# Altium schematic sheet DRV2700.SchDoc
size A4
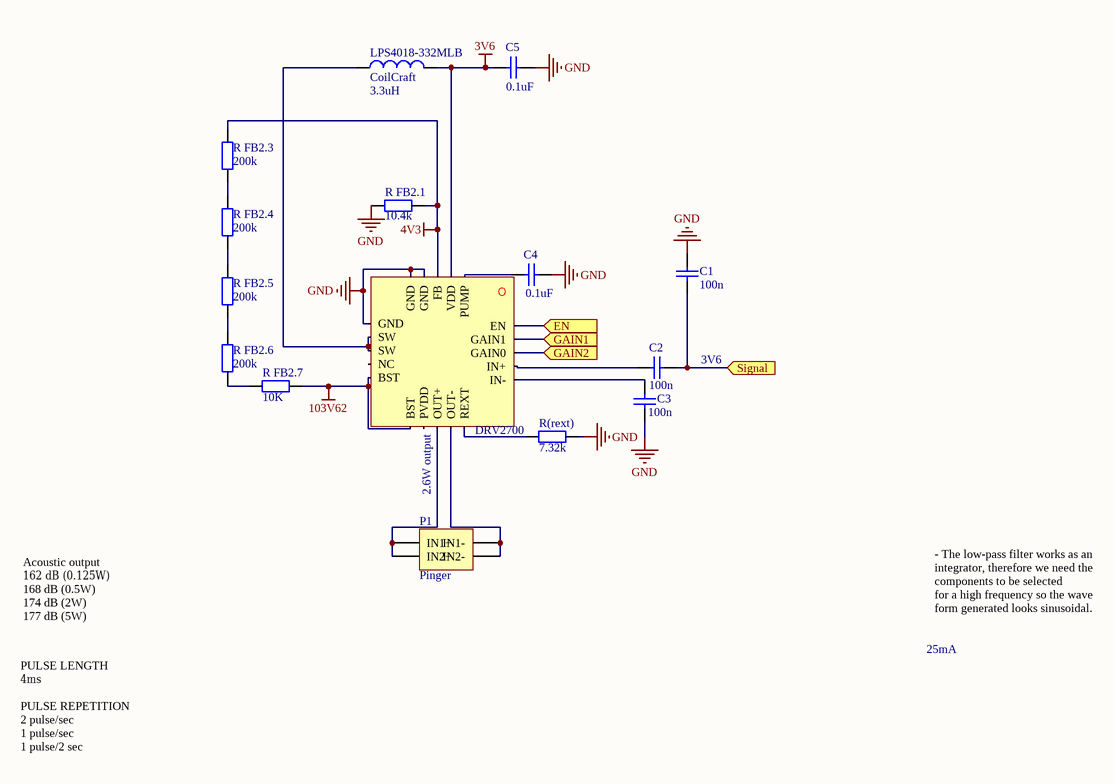
[diagram p0: DRV2700.SchDoc]

## Parts
C1  value 100n  [RAD-0.3]  (hidden comment: Cap)
C2  value 100n  [RAD-0.3]  (hidden comment: Cap)
C3  value 100n  [RAD-0.3]  (hidden comment: Cap)
C4  value 0.1uF  [RAD-0.3]  (hidden comment: +10V rating and X5R or X7R)
C5  value 0.1uF  [RAD-0.3]  (hidden comment: +10V rating and X5R or X7R)
DRV  DRV2700  [QFN50P400X400X100_HS-21N]
LPS4018-332MLB  CoilCraft  value 3.3uH  [0402-A]
P1  Pinger  [HDR2X2]
R(rext)  value 7.32k  [AXIAL-0.4]  (hidden comment: Res2)
R_FB2.1  value 10.4k  [AXIAL-0.4]  (hidden comment: Res2)
R_FB2.3  value 200k  [AXIAL-0.4]  (hidden comment: Res2)
R_FB2.4  value 200k  [AXIAL-0.4]  (hidden comment: Res2)
R_FB2.5  value 200k  [AXIAL-0.4]  (hidden comment: Res2)
R_FB2.6  value 200k  [AXIAL-0.4]  (hidden comment: Res2)
R_FB2.7  value 10K  [AXIAL-0.4]  (hidden comment: Res2)

## Ports
EN (in), GAIN1 (in), GAIN2 (in), Signal (in)

## Nets
3V6: C5.2 DRV.2(VDD) LPS4018-332MLB.2
4V3: DRV.3(FB) R_FB2.1.2 R_FB2.3.1
103V62: DRV.10(BST) DRV.11(BST) R_FB2.7.2
GND: C1.1 C3.1 C4.1 C5.1 DRV.4(GND) DRV.5(GND) DRV.6(GND) R(rext).1 R_FB2.1.1
EN: DRV.20(EN) ; port EN
GAIN1: DRV.19(GAIN1) ; port GAIN1
GAIN2: DRV.18(GAIN0) ; port GAIN2
Signal: C1.2 C2.1 ; port Signal
NetC2_2: C2.2 DRV.17(IN+)
NetC3_2: C3.2 DRV.16(IN-)
NetC4_2: C4.2 DRV.1(PUMP)
NetDRV_7: DRV.7(SW) DRV.8(SW) LPS4018-332MLB.1
NetDRV_13: DRV.13(OUT+) P1.1(IN1+) P1.3(IN2+)
NetDRV_14: DRV.14(OUT-) P1.2(IN1-) P1.4(IN2-)
NetDRV_15: DRV.15(REXT) R(rext).2
NetR_FB2.3_2: R_FB2.3.2 R_FB2.4.1
NetR_FB2.4_2: R_FB2.4.2 R_FB2.5.1
NetR_FB2.5_2: R_FB2.5.2 R_FB2.6.1
NetR_FB2.6_2: R_FB2.6.2 R_FB2.7.1

Not connected (* = marked no-connect by the designer): DRV 9(NC) 12(PVDD)

## Notes on the sheet
- (near C2) 3V6
- (near DRV) 2.6W output
- Acoustic output
  ​162 dB (0.125W)
  168 dB (0.5W)
  174 dB (2W)
  177 dB (5W)
- 25mA
- - The low-pass filter works as an integrator, therefore we need the components to be selected
  for a high frequency so the wave form generated looks sinusoidal.
- PULSE LENGTH
  ​4ms
  PULSE REPETITION
  2 pulse/sec
  1 pulse/sec
  1 pulse/2 sec

## Library data of the parts
C1 C4 C5 = Cap: Capacitor; Published: 8-Jun-2000; LatestRevisionDate: 17-Jul-2002; LatestRevisionNote: Re-released for DXP Platform.; PackageReference: RAD-0.3; Publisher: Altium Limited; PackageDescription: Radial Cap, Thru-Hole; 2 Leads; 0.3 in Pin Spacing
C2 = Cap: must have 105V rating; Published: 8-Jun-2000; LatestRevisionDate: 17-Jul-2002; LatestRevisionNote: Re-released for DXP Platform.; PackageReference: RAD-0.3; Publisher: Altium Limited; PackageDescription: Radial Cap, Thru-Hole; 2 Leads; 0.3 in Pin Spacing
C3 = Cap: must have a 105V rating; Published: 8-Jun-2000; LatestRevisionDate: 17-Jul-2002; LatestRevisionNote: Re-released for DXP Platform.; PackageReference: RAD-0.3; Publisher: Altium Limited; PackageDescription: Radial Cap, Thru-Hole; 2 Leads; 0.3 in Pin Spacing
LPS4018-332MLB = Inductor: Code_IEC: 1005; Published: 8-Jun-2000; LatestRevisionDate: 29-May-2009; LatestRevisionNote: IPC-7351 Footprint Added.; PackageReference: 0402-A; Publisher: Altium Limited; PackageDescription: Chip Inductor; Code_JEITA: 0402
P1 = Header 2X2: Header, 2-Pin, Dual row; LatestRevisionDate: 17-Jul-2002; LatestRevisionNote: Re-released for DXP Platform.; Publisher: Altium Limited
R(rext) = Res2: Current-Limiting Control Resistor; Published: 8-Jun-2000; LatestRevisionDate: 17-Jul-2002; LatestRevisionNote: Re-released for DXP Platform.; PackageReference: AXIAL-0.4; Publisher: Altium Limited; PackageDescription: Axial Device, Thru-Hole; 2 Leads; 0.4 in Pin Spacing
R_FB2.1 R_FB2.3-R_FB2.7 = Res2: Resistor; Published: 8-Jun-2000; LatestRevisionDate: 17-Jul-2002; LatestRevisionNote: Re-released for DXP Platform.; PackageReference: AXIAL-0.4; Publisher: Altium Limited; PackageDescription: Axial Device, Thru-Hole; 2 Leads; 0.4 in Pin Spacing
  R_FB2.3-R_FB2.7: Digikey: RC0201FR-07200KL
DRV = DRV2700: Supplier 1: Mouser; Supplier Part Number 1: 595-DRV2700RGPT